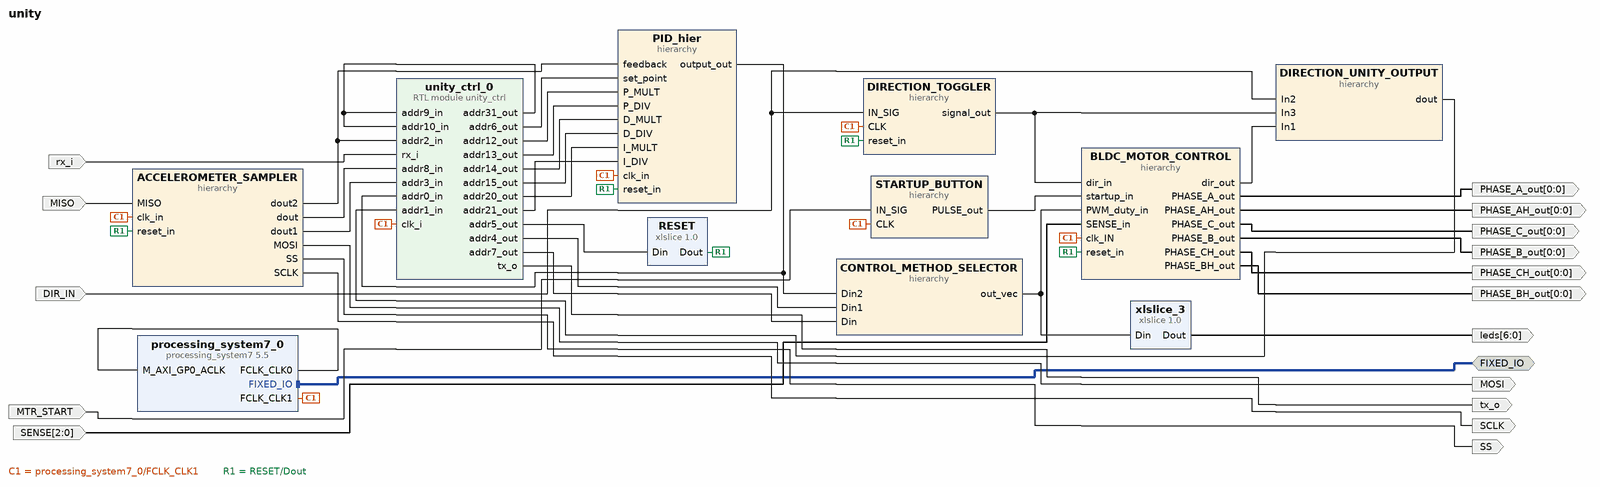
[diagram p0: block diagram of the top level]
# Vivado block design unity, xc7z010clg225-1, Vivado 2016.3
create_bd_design unity

create_bd_intf_port -mode Master -vlnv xilinx.com:display_processing_system7:fixedio_rtl:1.0 FIXED_IO
create_bd_port -dir I rx_i
create_bd_port -dir O tx_o
create_bd_port -dir I DIR_IN
create_bd_port -dir I MTR_START
create_bd_port -dir I -from 2 -to 0 SENSE
create_bd_port -dir O -from 0 -to 0 PHASE_C_out
create_bd_port -dir O -from 0 -to 0 PHASE_CH_out
create_bd_port -dir O -from 0 -to 0 PHASE_A_out
create_bd_port -dir O -from 0 -to 0 PHASE_B_out
create_bd_port -dir O -from 0 -to 0 PHASE_AH_out
create_bd_port -dir O -from 0 -to 0 PHASE_BH_out
create_bd_port -dir O -from 6 -to 0 leds
create_bd_port -dir O MOSI
create_bd_port -dir O SS
create_bd_port -dir O SCLK
create_bd_port -dir I MISO

create_bd_cell -type ip -vlnv xilinx.com:ip:processing_system7:5.5 processing_system7_0
set_property -dict [list \
  CONFIG.PCW_FCLK_CLK1_BUF TRUE \
  CONFIG.PCW_FCLK_CLK2_BUF TRUE \
  CONFIG.PCW_APU_PERIPHERAL_FREQMHZ 666.666666 \
  CONFIG.PCW_FPGA0_PERIPHERAL_FREQMHZ 50 \
  CONFIG.PCW_FPGA1_PERIPHERAL_FREQMHZ 200 \
  CONFIG.PCW_FPGA2_PERIPHERAL_FREQMHZ 100 \
  CONFIG.PCW_M_AXI_GP0_FREQMHZ 50 \
  CONFIG.PCW_NUM_F2P_INTR_INPUTS 1 \
  CONFIG.PCW_DQ_WIDTH 16 \
  CONFIG.PCW_DQS_WIDTH 2 \
  CONFIG.PCW_DM_WIDTH 2 \
  CONFIG.PCW_MIO_PRIMITIVE 32 \
  CONFIG.PCW_EN_CLK1_PORT 1 \
  CONFIG.PCW_EN_CLK2_PORT 1 \
  CONFIG.PCW_PERIPHERAL_BOARD_PRESET part0 \
  CONFIG.PCW_PRESET_BANK1_VOLTAGE {LVCMOS 3.3V} \
  CONFIG.PCW_UIPARAM_DDR_ENABLE 0 \
  CONFIG.PCW_QSPI_PERIPHERAL_ENABLE 1 \
  CONFIG.PCW_QSPI_QSPI_IO {MIO 1 .. 6} \
  CONFIG.PCW_QSPI_GRP_SINGLE_SS_ENABLE 1 \
  CONFIG.PCW_QSPI_GRP_SINGLE_SS_IO {MIO 1 .. 6} \
  CONFIG.PCW_ENET0_PERIPHERAL_ENABLE 0 \
  CONFIG.PCW_SD0_PERIPHERAL_ENABLE 0 \
  CONFIG.PCW_UART1_PERIPHERAL_ENABLE 0 \
  CONFIG.PCW_USB0_PERIPHERAL_ENABLE 0 \
  CONFIG.PCW_USB_RESET_ENABLE 1 \
  CONFIG.PCW_I2C_RESET_ENABLE 1 \
  CONFIG.PCW_GPIO_MIO_GPIO_ENABLE 1 \
  CONFIG.PCW_GPIO_MIO_GPIO_IO MIO \
  CONFIG.PCW_APU_CLK_RATIO_ENABLE 0.251400462962963 \
  CONFIG.PCW_ENET0_PERIPHERAL_CLKSRC External \
  CONFIG.PCW_UIPARAM_GENERATE_SUMMARY NONE \
  CONFIG.PCW_FPGA_FCLK1_ENABLE 1 \
  CONFIG.PCW_FPGA_FCLK2_ENABLE 1 \
] [get_bd_cells processing_system7_0]
# 388 more settings of processing_system7_0 are not shown: defaults, MIO pin electricals, DDR timing, and values the tool derives
create_bd_cell -type hier BLDC_MOTOR_CONTROL
create_bd_cell -type ip -vlnv xilinx.com:ip:xlslice:1.0 RESET
create_bd_cell -type ip -vlnv xilinx.com:ip:xlslice:1.0 xlslice_3
set_property -dict {CONFIG.DOUT_WIDTH 7 CONFIG.DIN_TO 0 CONFIG.DIN_FROM 6 CONFIG.DIN_WIDTH 8} [get_bd_cells xlslice_3]
create_bd_cell -type module -reference unity_ctrl unity_ctrl_0
create_bd_cell -type hier PID_hier
create_bd_cell -type hier ACCELEROMETER_SAMPLER
create_bd_cell -type hier CONTROL_METHOD_SELECTOR
create_bd_cell -type hier STARTUP_BUTTON
create_bd_cell -type hier DIRECTION_TOGGLER
create_bd_cell -type hier DIRECTION_UNITY_OUTPUT

# ---- hierarchy /BLDC_MOTOR_CONTROL ----
current_bd_instance /BLDC_MOTOR_CONTROL
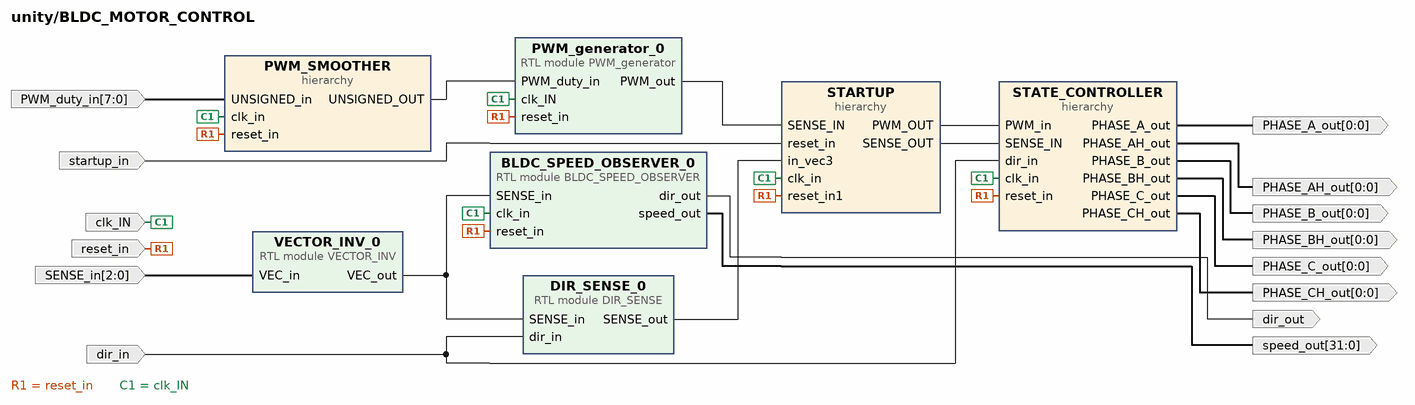
[diagram p1: block diagram inside /BLDC_MOTOR_CONTROL]
create_bd_pin -dir I dir_in
create_bd_pin -dir I -from 2 -to 0 SENSE_in
create_bd_pin -dir I -type rst startup_in
create_bd_pin -dir I clk_IN
create_bd_pin -dir I -from 7 -to 0 PWM_duty_in
create_bd_pin -dir O -from 0 -to 0 PHASE_A_out
create_bd_pin -dir O -from 0 -to 0 PHASE_B_out
create_bd_pin -dir O -from 0 -to 0 PHASE_C_out
create_bd_pin -dir O -from 0 -to 0 PHASE_AH_out
create_bd_pin -dir O -from 0 -to 0 PHASE_BH_out
create_bd_pin -dir O -from 0 -to 0 PHASE_CH_out
create_bd_pin -dir O dir_out
create_bd_pin -dir O -from 31 -to 0 speed_out
create_bd_pin -dir I -type rst reset_in

create_bd_cell -type module -reference VECTOR_INV VECTOR_INV_0
set_property -dict {CONFIG.SIZE 3} [get_bd_cells VECTOR_INV_0]
create_bd_cell -type module -reference DIR_SENSE DIR_SENSE_0
create_bd_cell -type module -reference BLDC_SPEED_OBSERVER BLDC_SPEED_OBSERVER_0
create_bd_cell -type module -reference PWM_generator PWM_generator_0
set_property -dict {CONFIG.PWM_FREQ 80000} [get_bd_cells PWM_generator_0]
create_bd_cell -type hier STATE_CONTROLLER
create_bd_cell -type hier STARTUP
create_bd_cell -type hier PWM_SMOOTHER

# ---- hierarchy /BLDC_MOTOR_CONTROL/STATE_CONTROLLER ----
current_bd_instance /BLDC_MOTOR_CONTROL/STATE_CONTROLLER
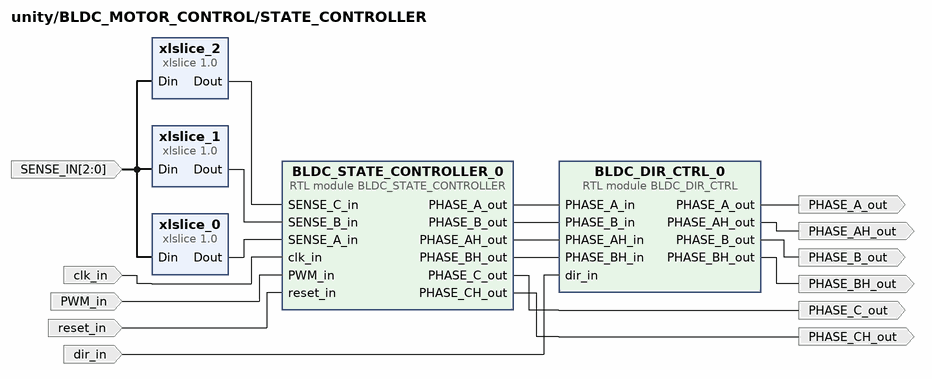
[diagram p2: block diagram inside /BLDC_MOTOR_CONTROL/STATE_CONTROLLER]
create_bd_pin -dir I -from 2 -to 0 SENSE_IN
create_bd_pin -dir O PHASE_C_out
create_bd_pin -dir I clk_in
create_bd_pin -dir I PWM_in
create_bd_pin -dir O PHASE_CH_out
create_bd_pin -dir I -type rst reset_in
create_bd_pin -dir O PHASE_A_out
create_bd_pin -dir O PHASE_AH_out
create_bd_pin -dir O PHASE_BH_out
create_bd_pin -dir I dir_in
create_bd_pin -dir O PHASE_B_out

create_bd_cell -type ip -vlnv xilinx.com:ip:xlslice:1.0 xlslice_0
set_property -dict {CONFIG.DOUT_WIDTH 1 CONFIG.DIN_TO 0 CONFIG.DIN_FROM 0 CONFIG.DIN_WIDTH 3} [get_bd_cells xlslice_0]
create_bd_cell -type ip -vlnv xilinx.com:ip:xlslice:1.0 xlslice_1
set_property -dict {CONFIG.DOUT_WIDTH 1 CONFIG.DIN_TO 1 CONFIG.DIN_FROM 1 CONFIG.DIN_WIDTH 3} [get_bd_cells xlslice_1]
create_bd_cell -type ip -vlnv xilinx.com:ip:xlslice:1.0 xlslice_2
set_property -dict {CONFIG.DOUT_WIDTH 1 CONFIG.DIN_TO 2 CONFIG.DIN_FROM 2 CONFIG.DIN_WIDTH 3} [get_bd_cells xlslice_2]
create_bd_cell -type module -reference BLDC_STATE_CONTROLLER BLDC_STATE_CONTROLLER_0
create_bd_cell -type module -reference BLDC_DIR_CTRL BLDC_DIR_CTRL_0

# ---- hierarchy /BLDC_MOTOR_CONTROL/STARTUP ----
current_bd_instance /BLDC_MOTOR_CONTROL/STARTUP
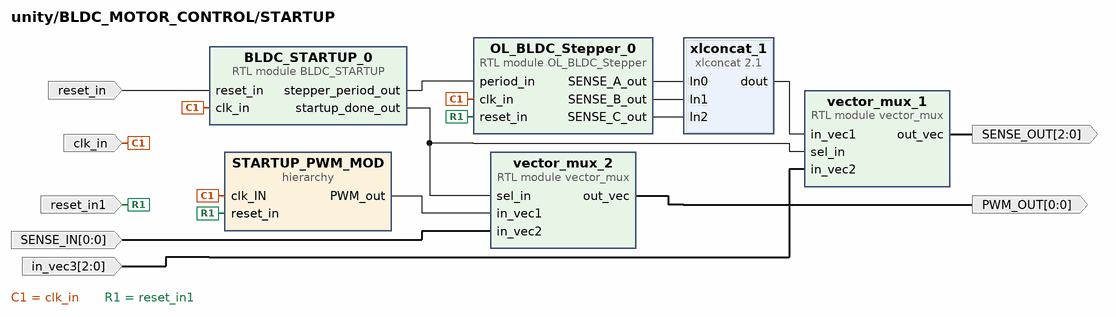
[diagram p3: block diagram inside /BLDC_MOTOR_CONTROL/STARTUP]
create_bd_pin -dir I -type rst reset_in
create_bd_pin -dir I clk_in
create_bd_pin -dir I -type rst reset_in1
create_bd_pin -dir I -from 0 -to 0 SENSE_IN
create_bd_pin -dir O -from 0 -to 0 PWM_OUT
create_bd_pin -dir I -from 2 -to 0 in_vec3
create_bd_pin -dir O -from 2 -to 0 SENSE_OUT

create_bd_cell -type module -reference BLDC_STARTUP BLDC_STARTUP_0
set_property -dict {CONFIG.START_PERIOD 1400000 CONFIG.END_PERIOD 300000 CONFIG.SPEEDUP_INTERVAL 55} [get_bd_cells BLDC_STARTUP_0]
create_bd_cell -type ip -vlnv xilinx.com:ip:xlconcat:2.1 xlconcat_1
set_property -dict {CONFIG.NUM_PORTS 3 CONFIG.IN0_WIDTH 1 CONFIG.IN1_WIDTH 1 CONFIG.IN2_WIDTH 1} [get_bd_cells xlconcat_1]
create_bd_cell -type module -reference OL_BLDC_Stepper OL_BLDC_Stepper_0
create_bd_cell -type hier STARTUP_PWM_MOD
create_bd_cell -type module -reference vector_mux vector_mux_1
set_property -dict {CONFIG.SIZE 3} [get_bd_cells vector_mux_1]
create_bd_cell -type module -reference vector_mux vector_mux_2
set_property -dict {CONFIG.SIZE 1} [get_bd_cells vector_mux_2]

# ---- hierarchy /BLDC_MOTOR_CONTROL/STARTUP/STARTUP_PWM_MOD ----
current_bd_instance /BLDC_MOTOR_CONTROL/STARTUP/STARTUP_PWM_MOD
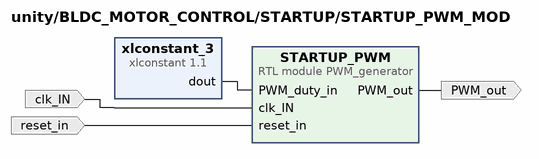
[diagram p4: block diagram inside /BLDC_MOTOR_CONTROL/STARTUP/STARTUP_PWM_MOD]
create_bd_pin -dir I clk_IN
create_bd_pin -dir O PWM_out
create_bd_pin -dir I -type rst reset_in

create_bd_cell -type ip -vlnv xilinx.com:ip:xlconstant:1.1 xlconstant_3
set_property -dict {CONFIG.CONST_WIDTH 8 CONFIG.CONST_VAL 0x29} [get_bd_cells xlconstant_3]
create_bd_cell -type module -reference PWM_generator STARTUP_PWM
set_property -dict {CONFIG.PWM_FREQ 80000} [get_bd_cells STARTUP_PWM]

# ---- hierarchy /BLDC_MOTOR_CONTROL/PWM_SMOOTHER ----
current_bd_instance /BLDC_MOTOR_CONTROL/PWM_SMOOTHER
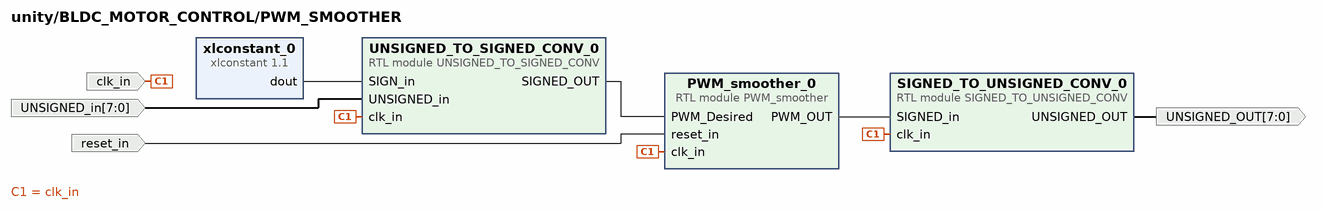
[diagram p5: block diagram inside /BLDC_MOTOR_CONTROL/PWM_SMOOTHER]
create_bd_pin -dir I clk_in
create_bd_pin -dir I -from 7 -to 0 UNSIGNED_in
create_bd_pin -dir I -type rst reset_in
create_bd_pin -dir O -from 7 -to 0 UNSIGNED_OUT

create_bd_cell -type module -reference UNSIGNED_TO_SIGNED_CONV UNSIGNED_TO_SIGNED_CONV_0
create_bd_cell -type ip -vlnv xilinx.com:ip:xlconstant:1.1 xlconstant_0
set_property -dict {CONFIG.CONST_VAL 0} [get_bd_cells xlconstant_0]
create_bd_cell -type module -reference PWM_smoother PWM_smoother_0
set_property -dict {CONFIG.SMOOTHING 10000} [get_bd_cells PWM_smoother_0]
create_bd_cell -type module -reference SIGNED_TO_UNSIGNED_CONV SIGNED_TO_UNSIGNED_CONV_0

# ---- hierarchy /PID_hier ----
current_bd_instance /PID_hier
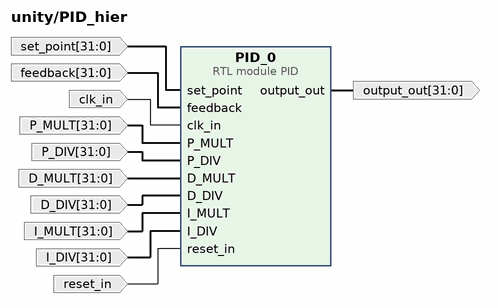
[diagram p6: block diagram inside /PID_hier]
create_bd_pin -dir I -from 31 -to 0 set_point
create_bd_pin -dir I -from 31 -to 0 feedback
create_bd_pin -dir O -from 31 -to 0 output_out
create_bd_pin -dir I clk_in
create_bd_pin -dir I -from 31 -to 0 P_MULT
create_bd_pin -dir I -from 31 -to 0 P_DIV
create_bd_pin -dir I -from 31 -to 0 D_MULT
create_bd_pin -dir I -from 31 -to 0 D_DIV
create_bd_pin -dir I -from 31 -to 0 I_MULT
create_bd_pin -dir I -from 31 -to 0 I_DIV
create_bd_pin -dir I -type rst reset_in

create_bd_cell -type module -reference PID PID_0
set_property -dict [list \
  CONFIG.SIZE 32 \
  CONFIG.MAX 255 \
  CONFIG.MIN 35 \
  CONFIG.SAMPLE_FREQ 100 \
  CONFIG.MAX_SUM 500000000 \
] [get_bd_cells PID_0]

# ---- hierarchy /ACCELEROMETER_SAMPLER ----
current_bd_instance /ACCELEROMETER_SAMPLER
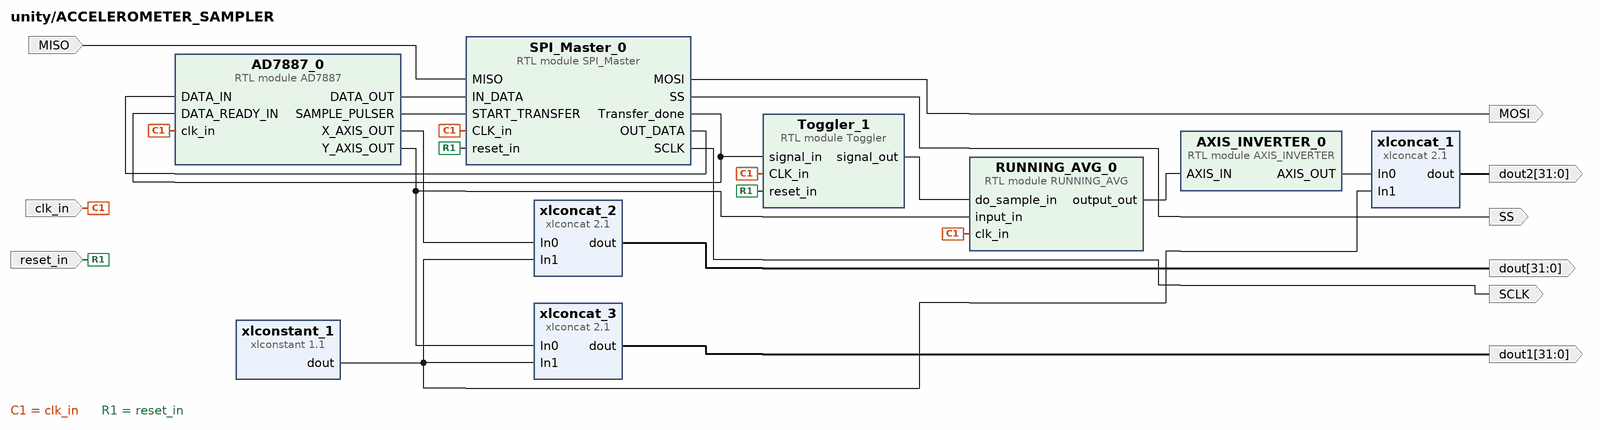
[diagram p7: block diagram inside /ACCELEROMETER_SAMPLER]
create_bd_pin -dir I clk_in
create_bd_pin -dir I MISO
create_bd_pin -dir O MOSI
create_bd_pin -dir O SS
create_bd_pin -dir O SCLK
create_bd_pin -dir I -type rst reset_in
create_bd_pin -dir O -from 31 -to 0 dout
create_bd_pin -dir O -from 31 -to 0 dout1
create_bd_pin -dir O -from 31 -to 0 dout2

create_bd_cell -type module -reference SPI_Master SPI_Master_0
set_property -dict {CONFIG.SS_CLK_DELAY 5 CONFIG.SCLK_FREQ 1500000} [get_bd_cells SPI_Master_0]
create_bd_cell -type module -reference AD7887 AD7887_0
set_property -dict {CONFIG.SAMPLE_FREQ 20000} [get_bd_cells AD7887_0]
create_bd_cell -type module -reference AXIS_INVERTER AXIS_INVERTER_0
create_bd_cell -type module -reference RUNNING_AVG RUNNING_AVG_0
set_property -dict {CONFIG.IN_SIZE 12 CONFIG.AVG_SIZE_BITS 8} [get_bd_cells RUNNING_AVG_0]
create_bd_cell -type ip -vlnv xilinx.com:ip:xlconcat:2.1 xlconcat_2
create_bd_cell -type ip -vlnv xilinx.com:ip:xlconcat:2.1 xlconcat_3
create_bd_cell -type ip -vlnv xilinx.com:ip:xlconstant:1.1 xlconstant_1
set_property -dict {CONFIG.CONST_WIDTH 20 CONFIG.CONST_VAL 0} [get_bd_cells xlconstant_1]
create_bd_cell -type ip -vlnv xilinx.com:ip:xlconcat:2.1 xlconcat_1
create_bd_cell -type module -reference Toggler Toggler_1

# ---- hierarchy /CONTROL_METHOD_SELECTOR ----
current_bd_instance /CONTROL_METHOD_SELECTOR
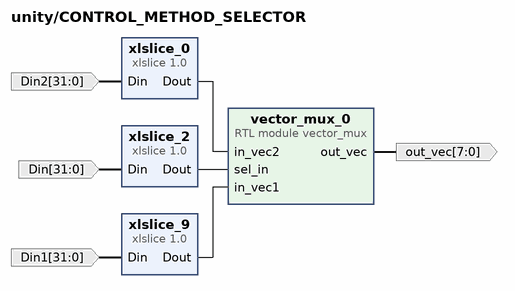
[diagram p8: block diagram inside /CONTROL_METHOD_SELECTOR]
create_bd_pin -dir I -from 31 -to 0 Din
create_bd_pin -dir O -from 7 -to 0 out_vec
create_bd_pin -dir I -from 31 -to 0 Din1
create_bd_pin -dir I -from 31 -to 0 Din2

create_bd_cell -type ip -vlnv xilinx.com:ip:xlslice:1.0 xlslice_2
create_bd_cell -type ip -vlnv xilinx.com:ip:xlslice:1.0 xlslice_9
set_property -dict {CONFIG.DOUT_WIDTH 8 CONFIG.DIN_TO 0 CONFIG.DIN_FROM 7} [get_bd_cells xlslice_9]
create_bd_cell -type ip -vlnv xilinx.com:ip:xlslice:1.0 xlslice_0
set_property -dict {CONFIG.DOUT_WIDTH 8 CONFIG.DIN_FROM 7} [get_bd_cells xlslice_0]
create_bd_cell -type module -reference vector_mux vector_mux_0

# ---- hierarchy /STARTUP_BUTTON ----
current_bd_instance /STARTUP_BUTTON
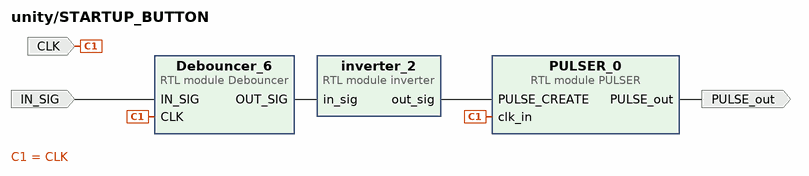
[diagram p9: block diagram inside /STARTUP_BUTTON]
create_bd_pin -dir I -type clk CLK
create_bd_pin -dir O PULSE_out
create_bd_pin -dir I IN_SIG

create_bd_cell -type module -reference PULSER PULSER_0
create_bd_cell -type module -reference Debouncer Debouncer_6
set_property -dict {CONFIG.THRESHOLD 100000} [get_bd_cells Debouncer_6]
create_bd_cell -type module -reference inverter inverter_2

# ---- hierarchy /DIRECTION_TOGGLER ----
current_bd_instance /DIRECTION_TOGGLER
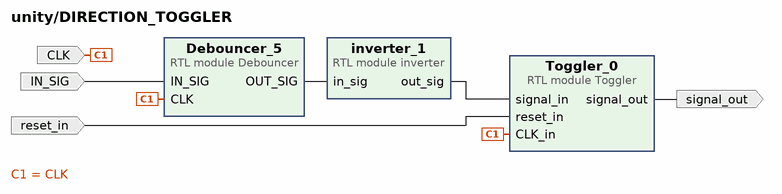
[diagram p10: block diagram inside /DIRECTION_TOGGLER]
create_bd_pin -dir I -type clk CLK
create_bd_pin -dir O signal_out
create_bd_pin -dir I -type rst reset_in
create_bd_pin -dir I IN_SIG

create_bd_cell -type module -reference inverter inverter_1
create_bd_cell -type module -reference Toggler Toggler_0
create_bd_cell -type module -reference Debouncer Debouncer_5
set_property -dict {CONFIG.THRESHOLD 100000} [get_bd_cells Debouncer_5]

# ---- hierarchy /DIRECTION_UNITY_OUTPUT ----
current_bd_instance /DIRECTION_UNITY_OUTPUT
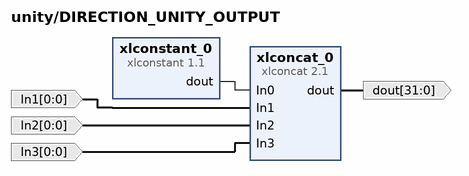
[diagram p11: block diagram inside /DIRECTION_UNITY_OUTPUT]
create_bd_pin -dir I -from 0 -to 0 In1
create_bd_pin -dir I -from 0 -to 0 In2
create_bd_pin -dir I -from 0 -to 0 In3
create_bd_pin -dir O -from 31 -to 0 dout

create_bd_cell -type ip -vlnv xilinx.com:ip:xlconstant:1.1 xlconstant_0
set_property -dict {CONFIG.CONST_WIDTH 29 CONFIG.CONST_VAL 0} [get_bd_cells xlconstant_0]
create_bd_cell -type ip -vlnv xilinx.com:ip:xlconcat:2.1 xlconcat_0
set_property -dict {CONFIG.NUM_PORTS 4} [get_bd_cells xlconcat_0]

# ---- connections ----

current_bd_instance /BLDC_MOTOR_CONTROL
connect_bd_net [get_bd_pins reset_in] \
  [get_bd_pins BLDC_SPEED_OBSERVER_0/reset_in] [get_bd_pins PWM_generator_0/reset_in] [get_bd_pins STATE_CONTROLLER/reset_in] \
  [get_bd_pins STARTUP/reset_in1] [get_bd_pins PWM_SMOOTHER/reset_in]
connect_bd_net -net inverter_2_out_sig [get_bd_pins startup_in] [get_bd_pins STARTUP/reset_in]
connect_bd_net -net processing_system7_0_FCLK_CLK1 [get_bd_pins clk_IN] \
  [get_bd_pins BLDC_SPEED_OBSERVER_0/clk_in] [get_bd_pins PWM_generator_0/clk_IN] [get_bd_pins STATE_CONTROLLER/clk_in] \
  [get_bd_pins STARTUP/clk_in] [get_bd_pins PWM_SMOOTHER/clk_in]
connect_bd_net [get_bd_pins SENSE_in] [get_bd_pins VECTOR_INV_0/VEC_in]
connect_bd_net [get_bd_pins VECTOR_INV_0/VEC_out] [get_bd_pins DIR_SENSE_0/SENSE_in] [get_bd_pins BLDC_SPEED_OBSERVER_0/SENSE_in]
connect_bd_net [get_bd_pins BLDC_SPEED_OBSERVER_0/dir_out] [get_bd_pins dir_out]
connect_bd_net [get_bd_pins BLDC_SPEED_OBSERVER_0/speed_out] [get_bd_pins speed_out]
connect_bd_net -net BLDC_STATE_CONTROLLER_0_PHASE_CH_out [get_bd_pins STATE_CONTROLLER/PHASE_CH_out] [get_bd_pins PHASE_CH_out]
connect_bd_net -net BLDC_STATE_CONTROLLER_0_PHASE_C_out [get_bd_pins STATE_CONTROLLER/PHASE_C_out] [get_bd_pins PHASE_C_out]
connect_bd_net [get_bd_pins PWM_duty_in] [get_bd_pins PWM_SMOOTHER/UNSIGNED_in]
connect_bd_net -net SIGNED_TO_UNSIGNED_CONV_0_UNSIGNED_OUT [get_bd_pins PWM_SMOOTHER/UNSIGNED_OUT] [get_bd_pins PWM_generator_0/PWM_duty_in]
connect_bd_net [get_bd_pins dir_in] [get_bd_pins DIR_SENSE_0/dir_in] [get_bd_pins STATE_CONTROLLER/dir_in]
connect_bd_net [get_bd_pins STATE_CONTROLLER/PHASE_A_out] [get_bd_pins PHASE_A_out]
connect_bd_net [get_bd_pins STATE_CONTROLLER/PHASE_AH_out] [get_bd_pins PHASE_AH_out]
connect_bd_net [get_bd_pins STATE_CONTROLLER/PHASE_BH_out] [get_bd_pins PHASE_BH_out]
connect_bd_net [get_bd_pins STATE_CONTROLLER/PHASE_B_out] [get_bd_pins PHASE_B_out]
connect_bd_net [get_bd_pins PWM_generator_0/PWM_out] [get_bd_pins STARTUP/SENSE_IN]
connect_bd_net -net PWM_in_1 [get_bd_pins STARTUP/PWM_OUT] [get_bd_pins STATE_CONTROLLER/PWM_in]
connect_bd_net [get_bd_pins DIR_SENSE_0/SENSE_out] [get_bd_pins STARTUP/in_vec3]
connect_bd_net -net Din_1 [get_bd_pins STARTUP/SENSE_OUT] [get_bd_pins STATE_CONTROLLER/SENSE_IN]

current_bd_instance /BLDC_MOTOR_CONTROL/STATE_CONTROLLER
connect_bd_net [get_bd_pins xlslice_0/Dout] [get_bd_pins BLDC_STATE_CONTROLLER_0/SENSE_A_in]
connect_bd_net [get_bd_pins xlslice_1/Dout] [get_bd_pins BLDC_STATE_CONTROLLER_0/SENSE_B_in]
connect_bd_net [get_bd_pins xlslice_2/Dout] [get_bd_pins BLDC_STATE_CONTROLLER_0/SENSE_C_in]
connect_bd_net -net vector_mux_1_out_vec [get_bd_pins SENSE_IN] [get_bd_pins xlslice_1/Din] [get_bd_pins xlslice_2/Din] [get_bd_pins xlslice_0/Din]
connect_bd_net [get_bd_pins BLDC_STATE_CONTROLLER_0/PHASE_C_out] [get_bd_pins PHASE_C_out]
connect_bd_net -net processing_system7_0_FCLK_CLK1 [get_bd_pins clk_in] [get_bd_pins BLDC_STATE_CONTROLLER_0/clk_in]
connect_bd_net -net vector_mux_2_out_vec [get_bd_pins PWM_in] [get_bd_pins BLDC_STATE_CONTROLLER_0/PWM_in]
connect_bd_net [get_bd_pins BLDC_STATE_CONTROLLER_0/PHASE_CH_out] [get_bd_pins PHASE_CH_out]
connect_bd_net [get_bd_pins reset_in] [get_bd_pins BLDC_STATE_CONTROLLER_0/reset_in]
connect_bd_net [get_bd_pins BLDC_DIR_CTRL_0/PHASE_A_out] [get_bd_pins PHASE_A_out]
connect_bd_net [get_bd_pins BLDC_DIR_CTRL_0/PHASE_AH_out] [get_bd_pins PHASE_AH_out]
connect_bd_net [get_bd_pins BLDC_DIR_CTRL_0/PHASE_BH_out] [get_bd_pins PHASE_BH_out]
connect_bd_net [get_bd_pins dir_in] [get_bd_pins BLDC_DIR_CTRL_0/dir_in]
connect_bd_net [get_bd_pins BLDC_DIR_CTRL_0/PHASE_B_out] [get_bd_pins PHASE_B_out]
connect_bd_net [get_bd_pins BLDC_STATE_CONTROLLER_0/PHASE_A_out] [get_bd_pins BLDC_DIR_CTRL_0/PHASE_A_in]
connect_bd_net [get_bd_pins BLDC_STATE_CONTROLLER_0/PHASE_B_out] [get_bd_pins BLDC_DIR_CTRL_0/PHASE_B_in]
connect_bd_net [get_bd_pins BLDC_STATE_CONTROLLER_0/PHASE_AH_out] [get_bd_pins BLDC_DIR_CTRL_0/PHASE_AH_in]
connect_bd_net [get_bd_pins BLDC_STATE_CONTROLLER_0/PHASE_BH_out] [get_bd_pins BLDC_DIR_CTRL_0/PHASE_BH_in]

current_bd_instance /BLDC_MOTOR_CONTROL/STARTUP
connect_bd_net [get_bd_pins BLDC_STARTUP_0/stepper_period_out] [get_bd_pins OL_BLDC_Stepper_0/period_in]
connect_bd_net [get_bd_pins OL_BLDC_Stepper_0/SENSE_A_out] [get_bd_pins xlconcat_1/In0]
connect_bd_net [get_bd_pins OL_BLDC_Stepper_0/SENSE_B_out] [get_bd_pins xlconcat_1/In1]
connect_bd_net [get_bd_pins OL_BLDC_Stepper_0/SENSE_C_out] [get_bd_pins xlconcat_1/In2]
connect_bd_net -net inverter_2_out_sig [get_bd_pins reset_in] [get_bd_pins BLDC_STARTUP_0/reset_in]
connect_bd_net -net processing_system7_0_FCLK_CLK1 [get_bd_pins clk_in] \
  [get_bd_pins OL_BLDC_Stepper_0/clk_in] [get_bd_pins BLDC_STARTUP_0/clk_in] [get_bd_pins STARTUP_PWM_MOD/clk_IN]
connect_bd_net [get_bd_pins reset_in1] [get_bd_pins OL_BLDC_Stepper_0/reset_in] [get_bd_pins STARTUP_PWM_MOD/reset_in]
connect_bd_net -net in_vec2_1 [get_bd_pins SENSE_IN] [get_bd_pins vector_mux_2/in_vec2]
connect_bd_net [get_bd_pins STARTUP_PWM_MOD/PWM_out] [get_bd_pins vector_mux_2/in_vec1]
connect_bd_net [get_bd_pins vector_mux_2/out_vec] [get_bd_pins PWM_OUT]
connect_bd_net [get_bd_pins xlconcat_1/dout] [get_bd_pins vector_mux_1/in_vec1]
connect_bd_net -net in_vec3_1 [get_bd_pins in_vec3] [get_bd_pins vector_mux_1/in_vec2]
connect_bd_net [get_bd_pins vector_mux_1/out_vec] [get_bd_pins SENSE_OUT]
connect_bd_net [get_bd_pins BLDC_STARTUP_0/startup_done_out] [get_bd_pins vector_mux_1/sel_in] [get_bd_pins vector_mux_2/sel_in]

current_bd_instance /BLDC_MOTOR_CONTROL/STARTUP/STARTUP_PWM_MOD
connect_bd_net [get_bd_pins xlconstant_3/dout] [get_bd_pins STARTUP_PWM/PWM_duty_in]
connect_bd_net -net processing_system7_0_FCLK_CLK1 [get_bd_pins clk_IN] [get_bd_pins STARTUP_PWM/clk_IN]
connect_bd_net [get_bd_pins STARTUP_PWM/PWM_out] [get_bd_pins PWM_out]
connect_bd_net [get_bd_pins reset_in] [get_bd_pins STARTUP_PWM/reset_in]

current_bd_instance /BLDC_MOTOR_CONTROL/PWM_SMOOTHER
connect_bd_net [get_bd_pins UNSIGNED_TO_SIGNED_CONV_0/SIGNED_OUT] [get_bd_pins PWM_smoother_0/PWM_Desired]
connect_bd_net [get_bd_pins xlconstant_0/dout] [get_bd_pins UNSIGNED_TO_SIGNED_CONV_0/SIGN_in]
connect_bd_net [get_bd_pins PWM_smoother_0/PWM_OUT] [get_bd_pins SIGNED_TO_UNSIGNED_CONV_0/SIGNED_in]
connect_bd_net -net processing_system7_0_FCLK_CLK1 [get_bd_pins clk_in] \
  [get_bd_pins SIGNED_TO_UNSIGNED_CONV_0/clk_in] [get_bd_pins PWM_smoother_0/clk_in] \
  [get_bd_pins UNSIGNED_TO_SIGNED_CONV_0/clk_in]
connect_bd_net -net PWM_duty_in_1 [get_bd_pins UNSIGNED_in] [get_bd_pins UNSIGNED_TO_SIGNED_CONV_0/UNSIGNED_in]
connect_bd_net [get_bd_pins reset_in] [get_bd_pins PWM_smoother_0/reset_in]
connect_bd_net [get_bd_pins SIGNED_TO_UNSIGNED_CONV_0/UNSIGNED_OUT] [get_bd_pins UNSIGNED_OUT]

current_bd_instance /PID_hier
connect_bd_net -net unity_ctrl_0_addr6_out [get_bd_pins set_point] [get_bd_pins PID_0/set_point]
connect_bd_net -net xlconcat_1_dout [get_bd_pins feedback] [get_bd_pins PID_0/feedback]
connect_bd_net [get_bd_pins PID_0/output_out] [get_bd_pins output_out]
connect_bd_net -net processing_system7_0_FCLK_CLK1 [get_bd_pins clk_in] [get_bd_pins PID_0/clk_in]
connect_bd_net -net unity_ctrl_0_addr12_out [get_bd_pins P_MULT] [get_bd_pins PID_0/P_MULT]
connect_bd_net -net unity_ctrl_0_addr13_out [get_bd_pins P_DIV] [get_bd_pins PID_0/P_DIV]
connect_bd_net -net unity_ctrl_0_addr14_out [get_bd_pins D_MULT] [get_bd_pins PID_0/D_MULT]
connect_bd_net -net unity_ctrl_0_addr15_out [get_bd_pins D_DIV] [get_bd_pins PID_0/D_DIV]
connect_bd_net -net unity_ctrl_0_addr20_out [get_bd_pins I_MULT] [get_bd_pins PID_0/I_MULT]
connect_bd_net -net unity_ctrl_0_addr21_out [get_bd_pins I_DIV] [get_bd_pins PID_0/I_DIV]
connect_bd_net -net xlslice_1_Dout [get_bd_pins reset_in] [get_bd_pins PID_0/reset_in]

current_bd_instance /ACCELEROMETER_SAMPLER
connect_bd_net [get_bd_pins AD7887_0/DATA_OUT] [get_bd_pins SPI_Master_0/IN_DATA]
connect_bd_net [get_bd_pins SPI_Master_0/OUT_DATA] [get_bd_pins AD7887_0/DATA_IN]
connect_bd_net [get_bd_pins AD7887_0/SAMPLE_PULSER] [get_bd_pins SPI_Master_0/START_TRANSFER]
connect_bd_net -net processing_system7_0_FCLK_CLK1 [get_bd_pins clk_in] \
  [get_bd_pins AD7887_0/clk_in] [get_bd_pins SPI_Master_0/CLK_in] [get_bd_pins RUNNING_AVG_0/clk_in] \
  [get_bd_pins Toggler_1/CLK_in]
connect_bd_net [get_bd_pins MISO] [get_bd_pins SPI_Master_0/MISO]
connect_bd_net [get_bd_pins SPI_Master_0/MOSI] [get_bd_pins MOSI]
connect_bd_net [get_bd_pins SPI_Master_0/SS] [get_bd_pins SS]
connect_bd_net [get_bd_pins SPI_Master_0/SCLK] [get_bd_pins SCLK]
connect_bd_net -net xlslice_1_Dout [get_bd_pins reset_in] [get_bd_pins SPI_Master_0/reset_in] [get_bd_pins Toggler_1/reset_in]
connect_bd_net [get_bd_pins SPI_Master_0/Transfer_done] [get_bd_pins AD7887_0/DATA_READY_IN] [get_bd_pins Toggler_1/signal_in]
connect_bd_net [get_bd_pins AD7887_0/Y_AXIS_OUT] [get_bd_pins RUNNING_AVG_0/input_in] [get_bd_pins xlconcat_3/In0]
connect_bd_net [get_bd_pins Toggler_1/signal_out] [get_bd_pins RUNNING_AVG_0/do_sample_in]
connect_bd_net [get_bd_pins RUNNING_AVG_0/output_out] [get_bd_pins AXIS_INVERTER_0/AXIS_IN]
connect_bd_net [get_bd_pins xlconcat_2/dout] [get_bd_pins dout]
connect_bd_net [get_bd_pins AD7887_0/X_AXIS_OUT] [get_bd_pins xlconcat_2/In0]
connect_bd_net -net In1_1 [get_bd_pins xlconstant_1/dout] [get_bd_pins xlconcat_2/In1] [get_bd_pins xlconcat_3/In1] [get_bd_pins xlconcat_1/In1]
connect_bd_net [get_bd_pins xlconcat_3/dout] [get_bd_pins dout1]
connect_bd_net [get_bd_pins AXIS_INVERTER_0/AXIS_OUT] [get_bd_pins xlconcat_1/In0]
connect_bd_net [get_bd_pins xlconcat_1/dout] [get_bd_pins dout2]

current_bd_instance /CONTROL_METHOD_SELECTOR
connect_bd_net [get_bd_pins xlslice_2/Dout] [get_bd_pins vector_mux_0/sel_in]
connect_bd_net [get_bd_pins xlslice_9/Dout] [get_bd_pins vector_mux_0/in_vec1]
connect_bd_net [get_bd_pins xlslice_0/Dout] [get_bd_pins vector_mux_0/in_vec2]
connect_bd_net -net unity_ctrl_0_addr7_out [get_bd_pins Din] [get_bd_pins xlslice_2/Din]
connect_bd_net -net PWM_duty_in_1 [get_bd_pins vector_mux_0/out_vec] [get_bd_pins out_vec]
connect_bd_net -net unity_ctrl_0_addr4_out [get_bd_pins Din1] [get_bd_pins xlslice_9/Din]
connect_bd_net -net PID_0_output_out [get_bd_pins Din2] [get_bd_pins xlslice_0/Din]

current_bd_instance /STARTUP_BUTTON
connect_bd_net [get_bd_pins inverter_2/out_sig] [get_bd_pins PULSER_0/PULSE_CREATE]
connect_bd_net [get_bd_pins Debouncer_6/OUT_SIG] [get_bd_pins inverter_2/in_sig]
connect_bd_net -net processing_system7_0_FCLK_CLK1 [get_bd_pins CLK] [get_bd_pins PULSER_0/clk_in] [get_bd_pins Debouncer_6/CLK]
connect_bd_net [get_bd_pins PULSER_0/PULSE_out] [get_bd_pins PULSE_out]
connect_bd_net -net DIR_IN1_1 [get_bd_pins IN_SIG] [get_bd_pins Debouncer_6/IN_SIG]

current_bd_instance /DIRECTION_TOGGLER
connect_bd_net [get_bd_pins Debouncer_5/OUT_SIG] [get_bd_pins inverter_1/in_sig]
connect_bd_net [get_bd_pins inverter_1/out_sig] [get_bd_pins Toggler_0/signal_in]
connect_bd_net -net processing_system7_0_FCLK_CLK1 [get_bd_pins CLK] [get_bd_pins Debouncer_5/CLK] [get_bd_pins Toggler_0/CLK_in]
connect_bd_net [get_bd_pins Toggler_0/signal_out] [get_bd_pins signal_out]
connect_bd_net -net xlslice_1_Dout [get_bd_pins reset_in] [get_bd_pins Toggler_0/reset_in]
connect_bd_net -net MOTOR_BTN_IN_1 [get_bd_pins IN_SIG] [get_bd_pins Debouncer_5/IN_SIG]

current_bd_instance /DIRECTION_UNITY_OUTPUT
connect_bd_net [get_bd_pins xlconstant_0/dout] [get_bd_pins xlconcat_0/In0]
connect_bd_net -net BLDC_MOTOR_CONTROL_dir_out [get_bd_pins In1] [get_bd_pins xlconcat_0/In1]
connect_bd_net -net MOTOR_BTN_IN_1 [get_bd_pins In2] [get_bd_pins xlconcat_0/In2]
connect_bd_net -net Toggler_0_signal_out [get_bd_pins In3] [get_bd_pins xlconcat_0/In3]
connect_bd_net [get_bd_pins xlconcat_0/dout] [get_bd_pins dout]

current_bd_instance /
connect_bd_intf_net [get_bd_intf_ports FIXED_IO] [get_bd_intf_pins processing_system7_0/FIXED_IO]
connect_bd_net [get_bd_pins processing_system7_0/FCLK_CLK0] [get_bd_pins processing_system7_0/M_AXI_GP0_ACLK]
connect_bd_net [get_bd_pins processing_system7_0/FCLK_CLK1] \
  [get_bd_pins unity_ctrl_0/clk_i] [get_bd_pins BLDC_MOTOR_CONTROL/clk_IN] [get_bd_pins PID_hier/clk_in] \
  [get_bd_pins ACCELEROMETER_SAMPLER/clk_in] [get_bd_pins STARTUP_BUTTON/CLK] [get_bd_pins DIRECTION_TOGGLER/CLK]
connect_bd_net [get_bd_ports rx_i] [get_bd_pins unity_ctrl_0/rx_i]
connect_bd_net [get_bd_pins unity_ctrl_0/tx_o] [get_bd_ports tx_o]
connect_bd_net -net MOTOR_BTN_IN_1 [get_bd_ports DIR_IN] [get_bd_pins DIRECTION_TOGGLER/IN_SIG] [get_bd_pins DIRECTION_UNITY_OUTPUT/In2]
connect_bd_net -net DIR_IN1_1 [get_bd_ports MTR_START] [get_bd_pins STARTUP_BUTTON/IN_SIG]
connect_bd_net -net Toggler_0_signal_out [get_bd_pins DIRECTION_TOGGLER/signal_out] \
  [get_bd_pins BLDC_MOTOR_CONTROL/dir_in] [get_bd_pins DIRECTION_UNITY_OUTPUT/In3]
connect_bd_net [get_bd_ports SENSE] [get_bd_pins BLDC_MOTOR_CONTROL/SENSE_in]
connect_bd_net -net BLDC_STATE_CONTROLLER_0_PHASE_C_out [get_bd_pins BLDC_MOTOR_CONTROL/PHASE_C_out] [get_bd_ports PHASE_C_out]
connect_bd_net -net BLDC_STATE_CONTROLLER_0_PHASE_CH_out [get_bd_pins BLDC_MOTOR_CONTROL/PHASE_CH_out] [get_bd_ports PHASE_CH_out]
connect_bd_net -net BLDC_STATE_CONTROLLER_0_PHASE_A_out [get_bd_pins BLDC_MOTOR_CONTROL/PHASE_A_out] [get_bd_ports PHASE_A_out]
connect_bd_net -net BLDC_STATE_CONTROLLER_0_PHASE_B_out [get_bd_pins BLDC_MOTOR_CONTROL/PHASE_B_out] [get_bd_ports PHASE_B_out]
connect_bd_net -net BLDC_STATE_CONTROLLER_0_PHASE_AH_out [get_bd_pins BLDC_MOTOR_CONTROL/PHASE_AH_out] [get_bd_ports PHASE_AH_out]
connect_bd_net -net BLDC_STATE_CONTROLLER_0_PHASE_BH_out [get_bd_pins BLDC_MOTOR_CONTROL/PHASE_BH_out] [get_bd_ports PHASE_BH_out]
connect_bd_net -net PULSER_0_PULSE_out [get_bd_pins STARTUP_BUTTON/PULSE_out] [get_bd_pins BLDC_MOTOR_CONTROL/startup_in]
connect_bd_net [get_bd_pins unity_ctrl_0/addr5_out] [get_bd_pins RESET/Din]
connect_bd_net -net xlslice_1_Dout [get_bd_pins RESET/Dout] \
  [get_bd_pins BLDC_MOTOR_CONTROL/reset_in] [get_bd_pins PID_hier/reset_in] [get_bd_pins ACCELEROMETER_SAMPLER/reset_in] \
  [get_bd_pins DIRECTION_TOGGLER/reset_in]
connect_bd_net [get_bd_pins unity_ctrl_0/addr4_out] [get_bd_pins CONTROL_METHOD_SELECTOR/Din1]
connect_bd_net -net xlconcat_0_dout [get_bd_pins DIRECTION_UNITY_OUTPUT/dout] [get_bd_pins unity_ctrl_0/addr1_in]
connect_bd_net [get_bd_pins BLDC_MOTOR_CONTROL/dir_out] [get_bd_pins DIRECTION_UNITY_OUTPUT/In1]
connect_bd_net [get_bd_pins xlslice_3/Dout] [get_bd_ports leds]
connect_bd_net -net SPI_Master_0_MOSI [get_bd_pins ACCELEROMETER_SAMPLER/MOSI] [get_bd_ports MOSI]
connect_bd_net -net SPI_Master_0_SS [get_bd_pins ACCELEROMETER_SAMPLER/SS] [get_bd_ports SS]
connect_bd_net -net SPI_Master_0_SCLK [get_bd_pins ACCELEROMETER_SAMPLER/SCLK] [get_bd_ports SCLK]
connect_bd_net [get_bd_ports MISO] [get_bd_pins ACCELEROMETER_SAMPLER/MISO]
connect_bd_net [get_bd_pins unity_ctrl_0/addr6_out] [get_bd_pins PID_hier/set_point]
connect_bd_net [get_bd_pins unity_ctrl_0/addr12_out] [get_bd_pins PID_hier/P_MULT]
connect_bd_net [get_bd_pins unity_ctrl_0/addr13_out] [get_bd_pins PID_hier/P_DIV]
connect_bd_net [get_bd_pins unity_ctrl_0/addr14_out] [get_bd_pins PID_hier/D_MULT]
connect_bd_net [get_bd_pins unity_ctrl_0/addr15_out] [get_bd_pins PID_hier/D_DIV]
connect_bd_net [get_bd_pins unity_ctrl_0/addr20_out] [get_bd_pins PID_hier/I_MULT]
connect_bd_net [get_bd_pins unity_ctrl_0/addr21_out] [get_bd_pins PID_hier/I_DIV]
connect_bd_net -net PWM_duty_in_1 [get_bd_pins CONTROL_METHOD_SELECTOR/out_vec] \
  [get_bd_pins xlslice_3/Din] [get_bd_pins BLDC_MOTOR_CONTROL/PWM_duty_in]
connect_bd_net [get_bd_pins unity_ctrl_0/addr7_out] [get_bd_pins CONTROL_METHOD_SELECTOR/Din]
connect_bd_net -net PID_0_output_out [get_bd_pins PID_hier/output_out] [get_bd_pins unity_ctrl_0/addr0_in] [get_bd_pins CONTROL_METHOD_SELECTOR/Din2]
connect_bd_net -net xlconcat_1_dout [get_bd_pins ACCELEROMETER_SAMPLER/dout2] [get_bd_pins unity_ctrl_0/addr2_in] [get_bd_pins PID_hier/feedback]
connect_bd_net [get_bd_pins unity_ctrl_0/addr31_out] [get_bd_pins unity_ctrl_0/addr10_in] [get_bd_pins unity_ctrl_0/addr9_in]
connect_bd_net [get_bd_pins ACCELEROMETER_SAMPLER/dout] [get_bd_pins unity_ctrl_0/addr8_in]
connect_bd_net [get_bd_pins ACCELEROMETER_SAMPLER/dout1] [get_bd_pins unity_ctrl_0/addr3_in]

validate_bd_design
save_bd_design
